# EAGLE design lucky7 (EAGLE 6.2)
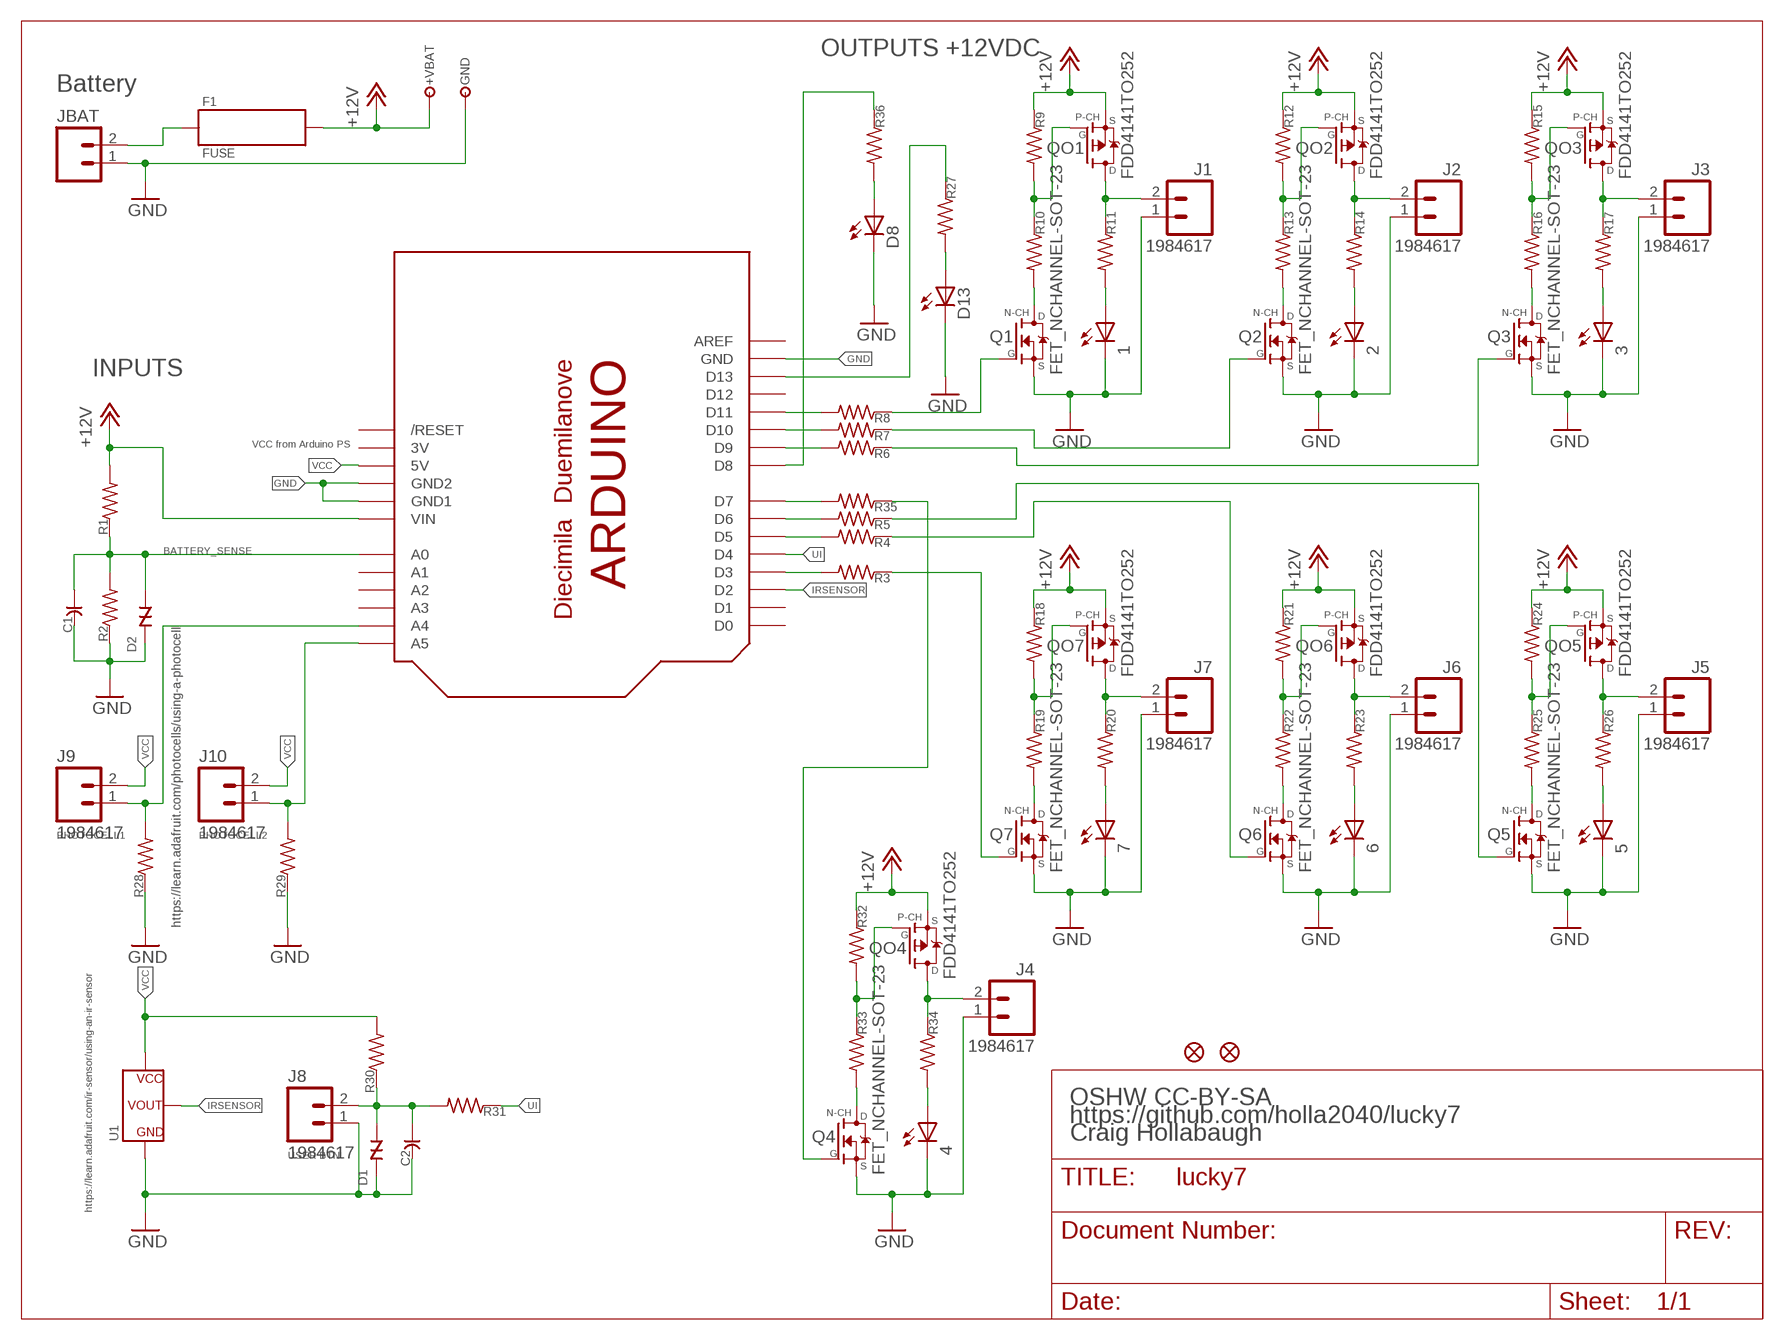
[diagram p0: schematic, sheet 1]

## Parts
1  LEDCHIP-LED0805  [CHIP-LED0805]
2  LEDCHIP-LED0805  [CHIP-LED0805]
3  LEDCHIP-LED0805  [CHIP-LED0805]
4  LEDCHIP-LED0805  [CHIP-LED0805]
5  LEDCHIP-LED0805  [CHIP-LED0805]
6  LEDCHIP-LED0805  [CHIP-LED0805]
7  LEDCHIP-LED0805  [CHIP-LED0805]
+VBAT  TESTPOINTTHRU  [TPTHRU]
C1  C-USC0603  [C0603]
C2  C-USC0603  [C0603]
D1  TVS0603  [TVS-0603]
D2  TVS0603  [TVS-0603]
D8  LEDCHIP-LED0805  [CHIP-LED0805]
D13  LEDCHIP-LED0805  [CHIP-LED0805]
F1  FUSE  [FUSE-3557-2]
GND  TESTPOINTTHRU  [TPTHRU]
J1  1984617  [1984617]
J2  1984617  [1984617]
J3  1984617  [1984617]
J4  1984617  [1984617]
J5  1984617  [1984617]
J6  1984617  [1984617]
J7  1984617  [1984617]
J8  1984617  [1984617]
J9  1984617  [1984617]
J10  1984617  [1984617]
JBAT  M02-6.35MM  [OSTT702]
JP1  FIDUCIAL1X2  [FIDUCIAL-1X2]
JP2  FIDUCIAL1X2  [FIDUCIAL-1X2]
Q1  FET_NCHANNEL-SOT-23  [SOT-23]
Q2  FET_NCHANNEL-SOT-23  [SOT-23]
Q3  FET_NCHANNEL-SOT-23  [SOT-23]
Q4  FET_NCHANNEL-SOT-23  [SOT-23]
Q5  FET_NCHANNEL-SOT-23  [SOT-23]
Q6  FET_NCHANNEL-SOT-23  [SOT-23]
Q7  FET_NCHANNEL-SOT-23  [SOT-23]
QO1  FDD4141TO252  [TO252]
QO2  FDD4141TO252  [TO252]
QO3  FDD4141TO252  [TO252]
QO4  FDD4141TO252  [TO252]
QO5  FDD4141TO252  [TO252]
QO6  FDD4141TO252  [TO252]
QO7  FDD4141TO252  [TO252]
R1  R-US_R0603  [R0603]
R2  R-US_R0603  [R0603]
R3  R-US_R0603  [R0603]
R4  R-US_R0603  [R0603]
R5  R-US_R0603  [R0603]
R6  R-US_R0603  [R0603]
R7  R-US_R0603  [R0603]
R8  R-US_R0603  [R0603]
R9  R-US_R0603  [R0603]
R10  R-US_R0603  [R0603]
R11  R-US_R0603  [R0603]
R12  R-US_R0603  [R0603]
R13  R-US_R0603  [R0603]
R14  R-US_R0603  [R0603]
R15  R-US_R0603  [R0603]
R16  R-US_R0603  [R0603]
R17  R-US_R0603  [R0603]
R18  R-US_R0603  [R0603]
R19  R-US_R0603  [R0603]
R20  R-US_R0603  [R0603]
R21  R-US_R0603  [R0603]
R22  R-US_R0603  [R0603]
R23  R-US_R0603  [R0603]
R24  R-US_R0603  [R0603]
R25  R-US_R0603  [R0603]
R26  R-US_R0603  [R0603]
R27  R-US_R0603  [R0603]
R28  R-US_R0603  [R0603]
R29  R-US_R0603  [R0603]
R30  R-US_R0603  [R0603]
R31  R-US_R0603  [R0603]
R32  R-US_R0603  [R0603]
R33  R-US_R0603  [R0603]
R34  R-US_R0603  [R0603]
R35  R-US_R0603  [R0603]
R36  R-US_R0603  [R0603]
U1  IRDETECTOR-THRU  [IRDETECTOR-THRU]
U100  ARDUINO-BPLACE  [ARDUINO-BPLACE]

## Nets
+12V: +VBAT.1 F1.2@1 F1.2@2 QO1.2(S) QO2.2(S) QO3.2(S) QO4.2(S) QO5.2(S) QO6.2(S) QO7.2(S) R1.2 R9.1 R12.1 R15.1 R18.1 R21.1 R24.1 R32.1 U100.VIN
BATTERY_SENSE: C1.1 D2.1 R1.1 R2.2 U100.A0
GND: 1.C 2.C 3.C 4.C 5.C 6.C 7.C C1.2 C2.2 D1.2 D2.2 D8.C D13.C GND.1 J1.1 J2.1 J3.1 J4.1 J5.1 J6.1 J7.1 J8.1 JBAT.1 Q1.3(S) Q2.3(S) Q3.3(S) Q4.3(S) Q5.3(S) Q6.3(S) Q7.3(S) R2.1 R28.1 R29.1 U1.GND U100.GND U100.GND1 U100.GND2
IRSENSOR: U1.VOUT U100.D2
N$1: QO1.1(G) R9.2 R10.1
N$2: Q1.1(D) R10.2
N$3: R8.2 U100.D11
N$4: J9.1 R28.2 U100.A4
N$5: 1.A R11.2
N$6: R7.2 U100.D10
N$7: R6.2 U100.D9
N$8: R5.2 U100.D6
N$9: R4.2 U100.D5
N$10: R3.2 U100.D3
N$11: QO2.1(G) R12.2 R13.1
N$12: Q2.1(D) R13.2
N$13: 2.A R14.2
N$14: QO3.1(G) R15.2 R16.1
N$15: Q3.1(D) R16.2
N$16: 3.A R17.2
N$17: QO7.1(G) R18.2 R19.1
N$18: Q7.1(D) R19.2
N$19: 7.A R20.2
N$20: QO6.1(G) R21.2 R22.1
N$21: Q6.1(D) R22.2
N$22: 6.A R23.2
N$23: QO5.1(G) R24.2 R25.1
N$24: Q5.1(D) R25.2
N$25: 5.A R26.2
N$26: Q1.2(G) R8.1
N$27: Q2.2(G) R7.1
N$28: Q3.2(G) R6.1
N$29: Q5.2(G) R5.1
N$30: Q6.2(G) R4.1
N$31: Q7.2(G) R3.1
N$32: J10.1 R29.2 U100.A5
N$33: C2.1 D1.1 J8.2 R30.1 R31.2
N$34: D13.A R27.2
N$35: R27.1 U100.D13
N$36: QO4.1(G) R32.2 R33.1
N$37: Q4.1(D) R33.2
N$38: D8.A R36.2
N$39: R36.1 U100.D8
N$40: 4.A R34.2
N$41: Q4.2(G) R35.1
N$42: R35.2 U100.D7
O1: J1.2 QO1.3(D) R11.1
O2: J2.2 QO2.3(D) R14.1
O3: J3.2 QO3.3(D) R17.1
O4: J4.2 QO4.3(D) R34.1
O5: J5.2 QO5.3(D) R26.1
O6: J6.2 QO6.3(D) R23.1
O7: J7.2 QO7.3(D) R20.1
UI: R31.1 U100.D4
VBAT: F1.1@1 F1.1@2 JBAT.2
VCC: J9.2 J10.2 R30.2 U1.VCC U100.5V
Unconnected: U100.A1 U100.A2 U100.A3 U100.AREF U100.D0 U100.D1 U100.D12 U100.RESET(/RESET)

## Notes on the sheet
- OUTPUTS +12VDC
- Battery
- INPUTS
- VCC from Arduino PS
- PHOTOCELL1 | PHOTOCELL2
- https://learn.adafruit.com/photocells/using-a-photocell
- OSHW CC-BY-SA
- https://github.com/holla2040/lucky7
- Craig Hollabaugh
- USER BTN
- https://learn.adafruit.com/ir-sensor/using-an-ir-sensor

## Power pins joined to a net without a drawn wire
3V: U100.3V

## Library data of the parts
1-7 D8 D13 = adafruit-2a72e41:LED: LED OSRAM: - CHIPLED LG R971, LG N971, LY N971, LG Q971, LY Q971, LO R971, LY R971 LH N974, LH R974 LS Q976, LO Q976, LY Q976 LO Q996 - Hyper CHIPLED LW Q18S LB Q993, LB Q99A, LB R99A - SideLED LS A670, LO A670, LY A670, LG A670, LP A670 LB A673, LV A673, LT A673, LW A673 LH A674 LY A675 LS A676, LA A676, LO A676, LY A676, LW A676 LS A679, LY A679, LG A679 - Hyper Micro SIDELED® LS Y876, LA Y876, LO Y876, LY Y876 LT Y87S - SmartLED LW L88C, LW L88S LB L89C, LB L89S, LG L890 LS L89K, LO L89K, LY L89K LS L896, LA L896, LO L896, LY L896 - TOPLED LS T670, LO T670, LY T670, LG T670, LP T670 LSG T670, LSP T670, LSY T670, LOP T670, LYG T670 LG T671, LOG T671, LSG T671 LB T673, LV T673, LT T673, LW T673 LH T674 LS T676, LA T676, LO T676, LY T676, LB T676, LH T676, LSB T676, LW T676 LB T67C, LV T67C, LT T67C, LS T67K, LO T67K, LY T67K, LW E67C LS E67B, LA E67B, LO E67B, LY E67B, LB E67C, LV E67C, LT E67C LW T67C LS T679, LY T679, LG T679 LS T770, LO T770, LY T770, LG T770, LP T770 LB T773, LV T773, LT T773, LW T773 LH T774 LS E675, LA E675, LY E675, LS T675 LS T776, LA T776, LO T776, LY T776, LB T776 LHGB T686 LT T68C, LB T68C - Hyper Mini TOPLED® LB M676 - Mini TOPLED Santana® LG M470 LS M47K, LO M47K, LY M47K Source: http://www.osram.convergy.de/
+VBAT GND = holla:TESTPOINT; DNP: 1
C1 C2 = holla:C
D1 D2 = holla:TVS: TVS Array ESDLC5V0D3B-TP Micro Commercial Co 5V 6V 350W 2 Channel Array - Bidirectional GBLC05C Protek Devices 0603 is CPDUR Series
F1 = holla:FUSE
J1-J10 = holla:1984617: Phoenix Contact CONN TERM BLOCK T/H 2POS 3.5MM
JBAT = holla:M02: CONN HEADER 2POS
JP1 JP2 = holla:FIDUCIAL: Fiducial Alignment Points Various fiducial points for machine vision alignment.; DNP: 1
Q1-Q7 = holla:FET_NCHANNEL
QO1-QO7 = holla:FDD4141: P-Channel PowerTrench® MOSFET Source: FDD4141.pdf
R1-R36 = holla:R
U1 = holla:IRDETECTOR: IR Detector equiv GP1UX311QS or TSOP38238
U100 = adafruit-2a72e41:ARDUINO: Arduino Diecimila/Duemilanove Make a shield with ease, this package has all the named pins as well as the two mounting drill holes and an outline of the USB and DC power connector. The outline is on the DIMENSION layer, so if your board house uses it they will cut the outline to match. http://www.ladyada.net/library/pcb/eaglelibrary.html

## Board
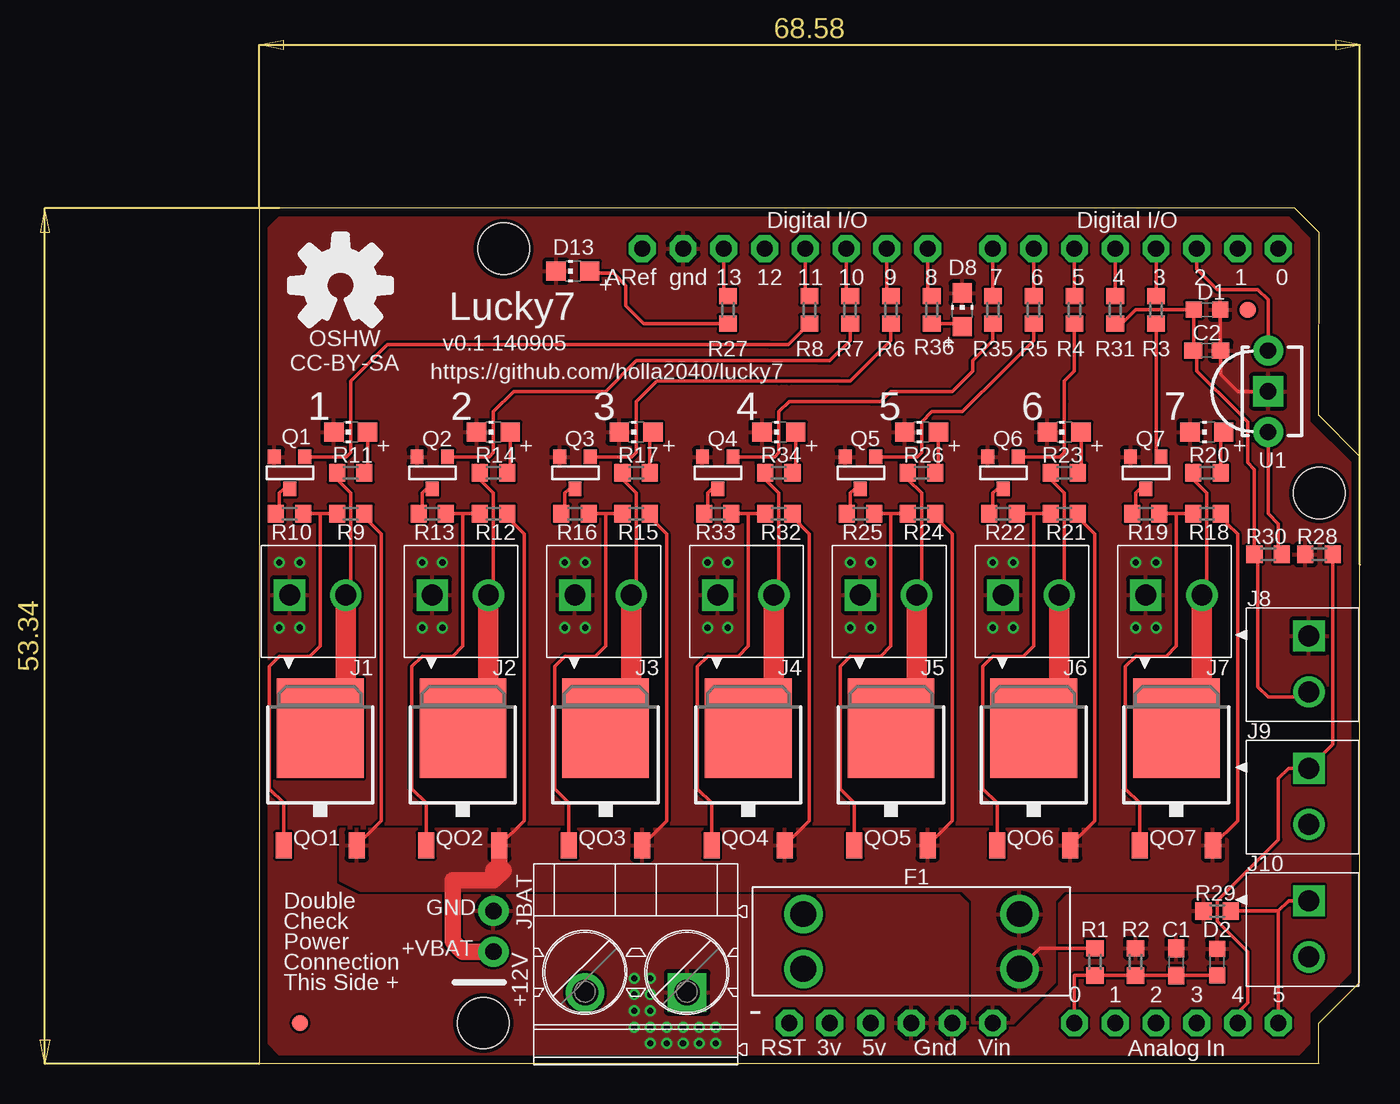
[diagram p1: board, top side]
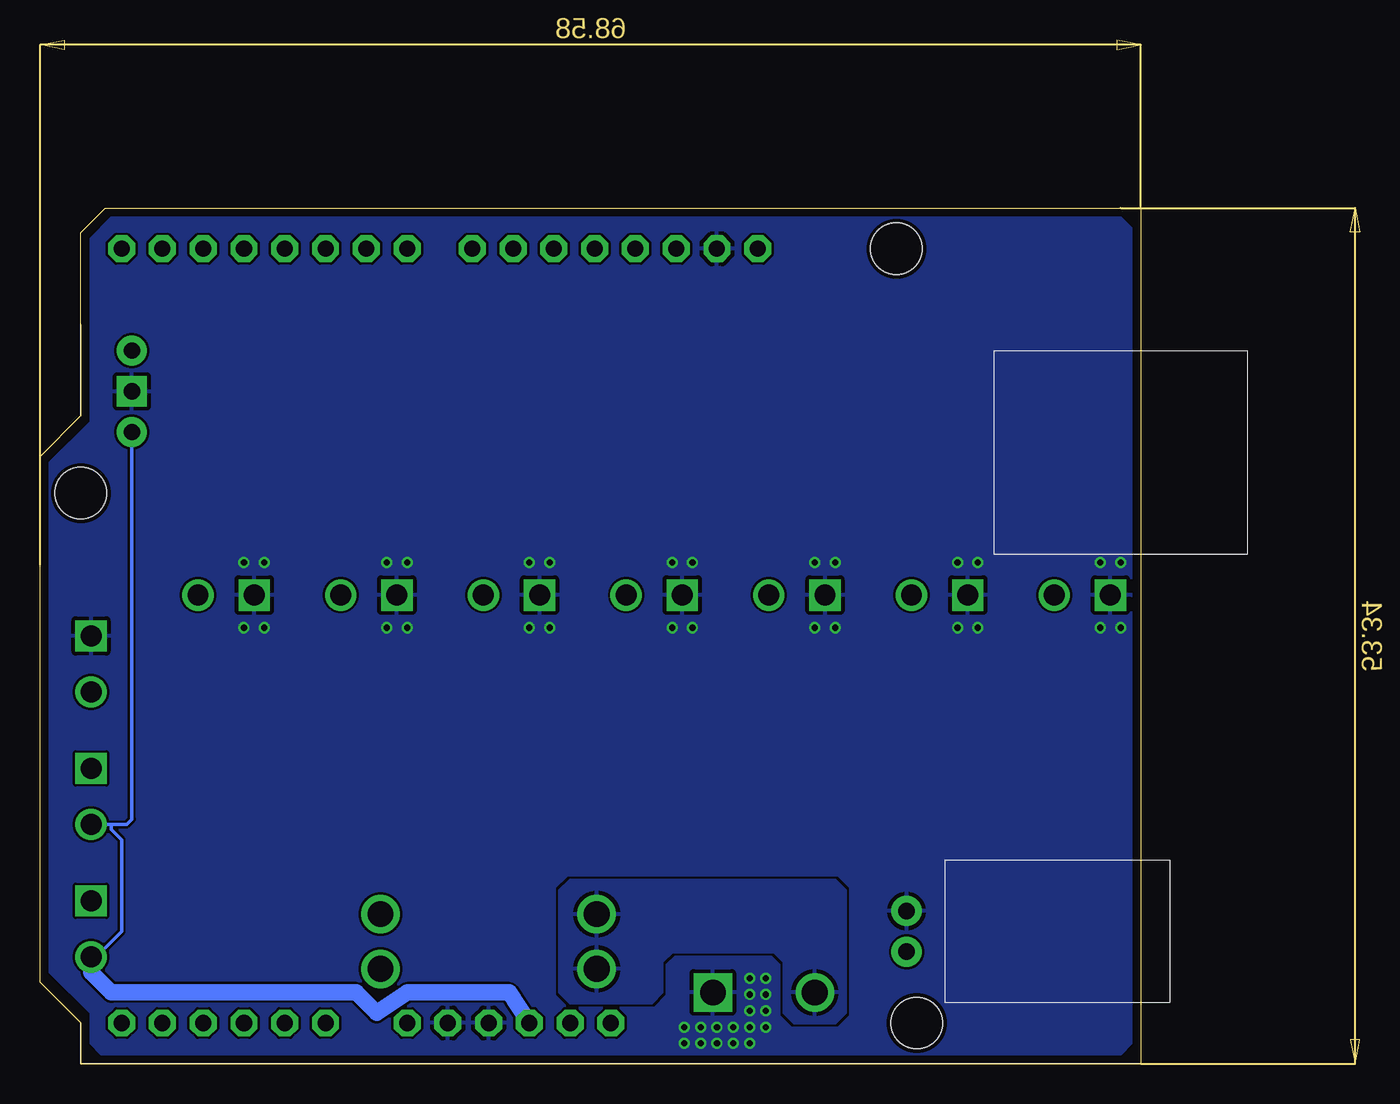
[diagram p2: board, bottom side, seen from below]

Size 68.58 x 53.34 mm. Coordinates in mm from the lower left corner, seen from the top.
Outline: 66.02,0 66.02,2.52 68.58,5.08 68.58,37.85 66.04,40.39 66.02,40.39 66.04,51.82 64.52,53.34 0,53.34 0,0 66.04,0
Copper layers (1*16): Top 0.035mm / dielectric 1.5mm / Bottom 0.035mm
Design rules: minimum track width 6mil, minimum drill 12mil, track to track 6mil, track to pad 6mil, pad to pad 6mil, via to via 6mil, smd to smd 0mil, copper to edge 10mil, drill to drill 10mil, minimum pad ring 10mil, minimum via ring 6mil, stop-mask expansion 2mil, vias tented up to drill 100mil, thermal gap 10mil

### Footprints (pad centres in the part's own frame; a part is rotated, then mirrored left to right if it is on the bottom)
CHIP-LED0805 = smd 1.2 x 1.2: A 0,-1.05; C 0,1.05
TPTHRU = drill 1.016 pad 1.88: 1 0,0
C0603 = smd 1.1 x 1: 1 -0.85,0; 2 0.85,0
TVS-0603 = smd 1 x 1: 1 -0.825,0; 2 0.825,0
FUSE-3557-2 = drill 1.6: 1@1 -6.731,-1.702; 1@2 -6.731,1.702; 2@1 6.731,-1.702; 2@2 6.731,1.702
1984617 = drill 1.3 square: 1 0,0 | drill 1.3: 2 3.5,0
OSTT702 = drill 1.6 square: 1 0,0 | drill 1.6: 2 6.35,0
FIDUCIAL-1X2 = smd 1 x 1: 1 0,0
SOT-23 = smd 0.8 x 0.9: 1 0,1; 2 -0.95,-1; 3 0.95,-1
TO252 = smd 1 x 1.6: 1 -2.28,-4.8; 2 2.28,-4.8 | smd 5.4 x 6.2: 3 0,2.5
R0603 = smd 1 x 1.1: 1 -0.85,0; 2 0.85,0
IRDETECTOR-THRU = drill 1.016 pad 1.88 square: GND 0,0 | drill 1.016 pad 1.88: VCC 2.54,0; VOUT -2.54,0
ARDUINO-BPLACE = drill 1 pad 1.676 octagon: 3V 35.56,2.54; 5V 38.1,2.54; A0 50.8,2.54; A1 53.34,2.54; A2 55.88,2.54; A3 58.42,2.54; A4 60.96,2.54; A5 63.5,2.54; AREF 23.876,50.8; D0 63.5,50.8; D1 60.96,50.8; D2 58.42,50.8; D3 55.88,50.8; D4 53.34,50.8; D5 50.8,50.8; D6 48.26,50.8; D7 45.72,50.8; D8 41.656,50.8; D9 39.116,50.8; D10 36.576,50.8; D11 34.036,50.8; D12 31.496,50.8; D13 28.956,50.8; GND 26.416,50.8; GND1 43.18,2.54; GND2 40.64,2.54; RESET 33.02,2.54; VIN 45.72,2.54 | hole 3.2: 15.24,50.8; 66.04,35.56; 13.97,2.54

### Placement (x,y rotation side)
1  5.71,39.37 90 top
2  14.61,39.37 90 top
3  23.5,39.37 90 top
4  32.38,39.37 90 top
5  41.27,39.37 90 top
6  50.16,39.37 90 top
7  59.05,39.37 90 top
+VBAT  14.61,6.99 0 top
C1  57.15,6.35 90 top
C2  59.05,44.45 0 top
D1  59.05,46.99 0 top
D2  59.69,6.35 90 top
D8  43.81,46.99 0 top
D13  19.56,49.4 90 top
F1  40.64,7.62 0 top
GND  14.61,9.53 0 top
J1  1.91,29.21 0 top
J2  10.79,29.21 0 top
J3  19.68,29.21 0 top
J4  28.57,29.21 0 top
J5  37.47,29.21 0 top
J6  46.35,29.21 0 top
J7  55.24,29.21 0 top
J8  65.41,26.67 270 top
J9  65.41,18.41 270 top
J10  65.41,10.16 270 top
JBAT  26.67,4.45 180 top
JP1  2.54,2.54 0 top
JP2  61.59,46.99 0 top
Q1  1.91,36.83 180 top
Q2  10.79,36.83 180 top
Q3  19.68,36.83 180 top
Q4  28.57,36.83 180 top
Q5  37.47,36.83 180 top
Q6  46.35,36.83 180 top
Q7  55.24,36.83 180 top
QO1  3.81,18.41 0 top
QO2  12.7,18.41 0 top
QO3  21.59,18.41 0 top
QO4  30.48,18.41 0 top
QO5  39.37,18.41 0 top
QO6  48.26,18.41 0 top
QO7  57.15,18.41 0 top
R1  52.07,6.35 90 top
R2  54.61,6.35 270 top
R3  55.88,46.99 90 top
R4  50.8,46.99 90 top
R5  48.26,46.99 90 top
R6  39.37,46.99 90 top
R7  36.83,46.99 90 top
R8  34.29,46.99 90 top
R9  5.71,34.29 180 top
R10  1.91,34.29 180 top
R11  5.71,36.83 0 top
R12  14.61,34.29 180 top
R13  10.79,34.29 180 top
R14  14.61,36.83 0 top
R15  23.5,34.29 180 top
R16  19.68,34.29 180 top
R17  23.5,36.83 0 top
R18  59.05,34.29 180 top
R19  55.24,34.29 180 top
R20  59.05,36.83 0 top
R21  50.16,34.29 180 top
R22  46.35,34.29 180 top
R23  50.16,36.83 0 top
R24  41.27,34.29 180 top
R25  37.47,34.29 180 top
R26  41.27,36.83 0 top
R27  29.21,46.99 270 top
R28  66.04,31.75 0 top
R29  59.69,9.53 0 top
R30  62.87,31.75 0 top
R31  53.34,46.99 270 top
R32  32.38,34.29 180 top
R33  28.57,34.29 180 top
R34  32.38,36.83 0 top
R35  45.72,46.99 90 top
R36  41.91,46.99 270 top
U1  62.87,41.91 270 top
U100  0,0 0 top

### Tracks (layer width: path | path; a pad name or v marks a point on that pad's centre or on a via)
+12V
  Top 0.203: R9.1 6.57,34.08 7.62,33.02 7.62,15.14 QO1.2 | R12.1 15.46,34.08 16.51,33.02 16.51,15.14 QO2.2 15.24,13.62 | R15.1 24.34,34.08 25.4,33.02 25.4,15.14 QO3.2 | R24.1 42.12,34.08 43.18,33.02 43.18,15.14 QO5.2 | R21.1 51.02,34.08 52.07,33.02 52.07,15.14 QO6.2 | R18.1 60.33,34.29 60.33,33.66 60.96,33.02 60.96,15.14 QO7.2 | R32.1 33.23,34.08 34.29,33.02 34.29,15.14 QO4.2 | R1.2 48.65,7.2 F1.2@1
  Top 1.016: +VBAT.1 12.7,6.99 12.06,7.62 12.06,11.43 14.61,11.43 15.24,12.06 14.61,12.06 14.98,12.44 QO2.2
  pour Top: 5.08,14.61 59.69,14.61 60.33,13.97 60.33,11.43 59.69,10.79 50.16,10.79 49.53,10.16 49.53,5.08 46.99,2.54 44.45,2.54 44.45,10.16 43.81,10.79 6.35,10.79 5.08,11.43
BATTERY_SENSE
  Top 0.203: D2.1 58.4,5.5 C1.1 R2.2 R1.1 50.8,5.5 U100.A0
GND  (via drill 0.38)  (1 unrouted)
  Top 0.203: D1.2 59.88,44.48 C2.2 59.91,42.97 60.96,41.91 U1.GND
  other vias: 23.37,5.33 24.38,5.33 23.37,4.32 24.38,4.32 23.37,3.3 24.38,3.3 23.37,2.29 24.38,2.29 25.4,2.29 26.42,2.29 27.43,2.29 28.45,2.29 24.38,1.27 25.4,1.27 26.42,1.27 27.43,1.27 28.45,1.27 1.27,31.24 2.54,31.24 1.27,27.18 2.54,27.18 10.16,31.24 11.43,31.24 10.16,27.18 11.43,27.18 19.05,31.24 20.32,31.24 19.05,27.18 20.32,27.18 27.94,31.24 29.21,31.24 27.94,27.18 29.21,27.18 36.83,31.24 38.1,31.24 36.83,27.18 38.1,27.18 45.72,31.24 46.99,31.24 45.72,27.18 46.99,27.18 54.61,31.24 55.88,31.24 54.61,27.18 55.88,27.18
  pour Top (rank 3): 1.27,52.7 64.14,52.7 65.41,51.44 65.41,40.01 67.94,37.47 67.94,5.71 65.41,3.17 65.41,1.27 64.77,0.64 1.27,0.64 0.64,1.27 0.64,52.07
  pour Bottom (rank 2): 0.64,1.27 0.64,52.07 1.27,52.7 64.14,52.7 65.41,51.44 65.41,40.01 67.94,37.47 67.94,5.71 65.41,3.17 65.41,1.27 64.77,0.64 1.27,0.64
IRSENSOR
  Top 0.203: U100.D2 58.42,49.53 59.69,48.26 62.23,48.26 62.87,47.62 U1.VOUT
N$1
  Top 0.203: R10.1 3.81,34.29 | 3.81,34.29 R9.2 | QO1.1 1.53,16.25 0.64,17.14 0.64,24.77 1.27,25.4 3.17,25.4 3.81,26.04 3.81,34.29
N$2
  Top 0.203: Q1.1 1.54,35.83 1.27,35.56 1.27,34.51 R10.2
N$3
  Top 0.203: U100.D11 34.04,48.09 R8.2
N$4
  Top 0.203: U100.A4 60.96,3.17 61.59,3.81 61.59,6.99 59.69,8.89 59.69,10.16 63.5,13.97 63.5,17.78 64.14,18.41 J9.1 66.89,19.9 R28.2
N$5
  Top 0.203: R11.2 6.76,37.03 1.A
N$6
  Top 0.203: U100.D10 36.58,48.09 R7.2
N$7
  Top 0.203: U100.D9 39.12,48.09 R6.2
N$8
  Top 0.203: U100.D6 R5.2
N$9
  Top 0.203: U100.D5 R4.2
N$10
  Top 0.203: U100.D3 R3.2
N$11
  Top 0.203: R12.2 12.7,34.29 | 12.7,34.29 R13.1 | QO2.1 10.42,16.25 9.53,17.14 9.53,24.77 10.16,25.4 12.06,25.4 12.7,26.04 12.7,34.29
N$12
  Top 0.203: Q2.1 10.43,35.83 10.16,35.56 10.16,34.51 R13.2
N$13
  Top 0.203: 2.A 15.65,37.03 R14.2
N$14
  Top 0.203: R16.1 21.59,34.29 | 21.59,34.29 R15.2 | QO3.1 19.31,16.25 18.41,17.14 18.41,24.77 19.05,25.4 20.95,25.4 21.59,26.04 21.59,34.29
N$15
  Top 0.203: Q3.1 19.32,35.83 19.05,35.56 19.05,34.51 R16.2
N$16
  Top 0.203: 24.77,39.37 3.A 24.34,39.17 R17.2
N$17
  Top 0.203: R18.2 57.15,34.29 | 57.15,34.29 R19.1 | QO7.1 54.87,16.25 53.98,17.14 53.98,24.77 54.61,25.4 56.52,25.4 57.15,26.04 57.15,34.29
N$18
  Top 0.203: Q7.1 54.88,35.83 54.61,35.56 54.61,34.51 R19.2
N$19
  Top 0.203: R20.2 59.91,39.17 7.A
N$20
  Top 0.203: R21.2 48.26,34.29 | 48.26,34.29 R22.1 | QO6.1 45.98,16.25 45.09,17.14 45.09,24.77 45.72,25.4 47.62,25.4 48.26,26.04 48.26,34.29
N$21
  Top 0.203: Q6.1 45.99,35.83 45.72,35.56 45.72,34.51 R22.2
N$22
  Top 0.203: 6.A 51.22,37.03 R23.2
N$23
  Top 0.203: R24.2 39.37,34.29 | 39.37,34.29 R25.1 | QO5.1 37.09,16.25 36.2,17.14 36.2,24.77 36.83,25.4 38.73,25.4 39.37,26.04 39.37,34.29
N$24
  Top 0.203: Q5.1 37.1,35.83 36.83,35.56 36.83,34.51 R25.2
N$25
  Top 0.203: 5.A 42.33,37.03 R26.2
N$26
  Top 0.203: Q1.2 5.45,37.83 5.71,38.1 5.71,42.55 8,44.83 8.26,44.83 31.75,44.83 32.98,44.83 R8.1
N$27
  Top 0.203: Q2.2 14.34,37.83 14.61,38.1 14.61,40.64 15.88,41.91 21.59,41.91 23.5,43.81 31.75,43.81 34.92,43.81 35.56,43.81 36.83,45.09 R7.1 36.62,46.14
N$28
  Top 0.203: Q3.2 23.23,37.83 23.5,38.1 23.5,41.27 24.77,42.55 32.38,42.55 33.02,42.55 36.2,42.55 36.83,42.55 39.37,45.09 R6.1
N$29
  Top 0.203: Q5.2 41.01,37.83 41.27,38.1 41.27,40.01 41.91,40.64 43.81,40.64 46.35,43.18 48.26,45.09 R5.1
N$30
  Top 0.203: Q6.2 49.9,37.83 50.16,38.1 50.16,41.27 50.16,42.55 50.8,43.18 R4.1
N$31
  Top 0.203: R3.1 55.88,38.15 Q7.2
N$32
  Top 0.203: 64.14,10.16 J10.1 64.14,10.16 | 64.14,10.16 63.5,9.53 | 63.5,9.53 U100.A5 | R29.2 63.5,9.53
N$33
  Top 0.203: R31.2 53.76,46.14 54.61,46.99 D1.1 58.23,44.48 C2.1 58.42,44.23 58.42,43.18 60.96,40.64 61.59,40.01 61.59,37.47 62.02,37.05 R30.1 62.23,31.54 62.23,23.5 62.87,22.86 65.09,22.86 J8.2
N$34
  Top 0.203: R27.2 23.96,46.14 22.86,47.24 22.86,48.51 22.1,49.28 20.73,49.28 D13.A
N$35
  Top 0.203: U100.D13 28.96,48.09 R27.1
N$36
  Top 0.203: R33.1 30.48,34.29 | 30.48,34.29 R32.2 | QO4.1 28.2,16.25 27.3,17.14 27.3,24.77 27.94,25.4 29.84,25.4 30.48,26.04 30.48,34.29
N$37
  Top 0.203: Q4.1 28.21,35.83 27.94,35.56 27.94,34.51 R33.2
N$38
  Top 0.203: R36.2 41.7,46.14 43.62,46.14 D8.A
N$39
  Top 0.203: U100.D8 41.66,48.09 R36.1
N$40
  Top 0.203: 4.A 33.44,37.03 R34.2
N$41
  Top 0.203: Q4.2 32.12,37.83 32.38,38.1 32.38,40.01 32.38,40.64 33.02,41.27 38.1,41.27 38.73,41.27 39.37,41.91 43.18,41.91 44.45,43.18 44.45,43.81 45.72,45.09 R35.1
N$42
  Top 0.203: U100.D7 R35.2
O1
  Top 0.203: R11.1 4.87,36.41 5.71,35.56 5.71,29.52 J1.2
  Top 1.27: J1.2 5.41,22.51 QO1.3
O2
  Top 0.203: R14.1 13.76,36.41 14.61,35.56 14.61,29.52 J2.2
  Top 1.27: J2.2 14.29,22.51 QO2.3
O3
  Top 0.203: R17.1 22.64,36.41 23.5,35.56 23.5,29.52 J3.2
  Top 1.27: J3.2 23.18,22.51 QO3.3
O4
  Top 0.203: R34.1 31.54,36.41 32.38,35.56 32.38,29.52 J4.2
  Top 1.27: J4.2 32.08,22.51 QO4.3
O5
  Top 0.203: R26.1 40.42,36.41 41.27,35.56 41.27,29.52 J5.2
  Top 1.27: J5.2 40.97,22.51 QO5.3
O6
  Top 0.203: R23.1 49.31,36.41 50.16,35.56 50.16,29.52 J6.2
  Top 1.27: J6.2 49.85,22.51 QO6.3
O7
  Top 0.203: R20.1 58.2,36.41 59.05,35.56 59.05,29.52 J7.2
  Top 1.27: J7.2 58.74,22.51 QO7.3
UI
  Top 0.203: U100.D4 R31.1
VBAT
  pour Bottom: 18.41,10.79 18.41,3.17 19.05,2.54 21.59,2.54 22.23,3.17 22.23,6.35 22.86,6.99 29.21,6.99 29.84,6.35 29.84,4.45 30.48,3.81 35.56,3.81 36.2,4.45 36.2,10.79 35.56,11.43 19.05,11.43
VCC
  Top 0.203: U1.VCC 62.87,34.29 63.5,33.66 63.5,33.02 63.5,31.75 R30.2
  Bottom 0.203: J10.2 65.09,6.66 63.5,8.26 63.5,13.97 64.14,14.61 64.14,14.91 | J9.2 64.14,14.91 | 64.14,14.91 63.19,14.91 62.87,15.24 U1.VCC
  Bottom 1.016: U100.5V 39.37,4.45 45.72,4.45 47.62,3.17 48.9,4.45 64.14,4.45 65.41,5.71 J10.2

### Text on the board
tNames: Lucky7 | OSHW | CC-BY-SA | v0.1 140905 | https://github.com/holla2040/lucky7 | Double | Check | Power | Connection | This Side + | +12V | -